# EAGLE design KW-104AL (EAGLE 6.5.0)
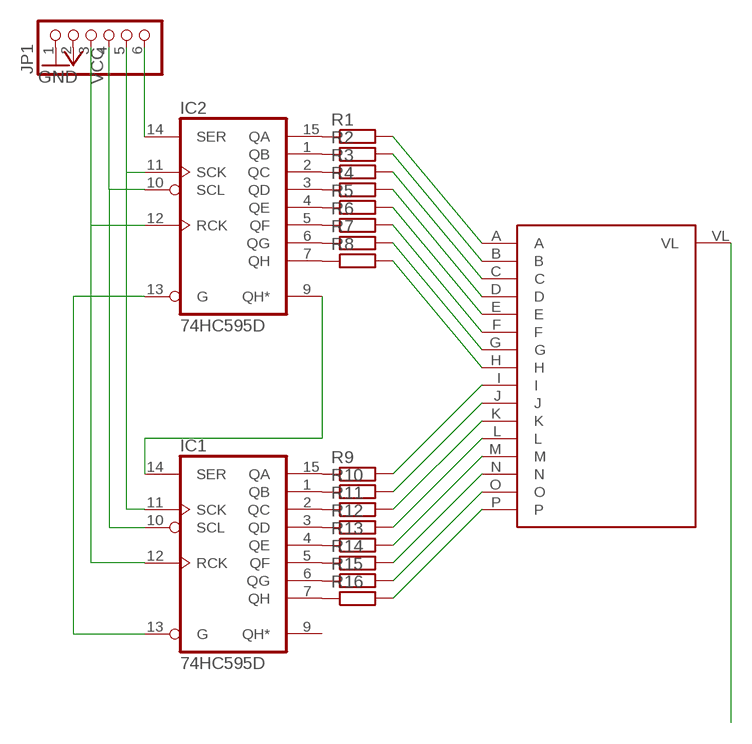
[diagram p0: schematic, sheet 1]

## Parts
IC1  74HC595D  [SO16]
IC2  74HC595D  [SO16]
JP1  PINHD-1X6CB  [1X06-CLEANBIG]
R1  R-EU_R0402  [R0402]
R2  R-EU_R0402  [R0402]
R3  R-EU_R0402  [R0402]
R4  R-EU_R0402  [R0402]
R5  R-EU_R0402  [R0402]
R6  R-EU_R0402  [R0402]
R7  R-EU_R0402  [R0402]
R8  R-EU_R0402  [R0402]
R9  R-EU_R0402  [R0402]
R10  R-EU_R0402  [R0402]
R11  R-EU_R0402  [R0402]
R12  R-EU_R0402  [R0402]
R13  R-EU_R0402  [R0402]
R14  R-EU_R0402  [R0402]
R15  R-EU_R0402  [R0402]
R16  R-EU_R0402  [R0402]
U$1  1.27KW-104AL  [127]

## Nets
GND: JP1.1
N$1: IC1.14(SER) IC2.9(QH*)
N$2: IC1.11(SCK) IC2.11(SCK) JP1.5
N$3: IC1.10(SCL) IC2.10(SCL) JP1.4
N$4: IC1.12(RCK) IC2.12(RCK) JP1.3
N$5: IC1.13(G) IC2.13(G)
N$6: IC2.15(QA) R1.1
N$7: IC2.1(QB) R2.1
N$8: IC2.2(QC) R3.1
N$9: IC2.3(QD) R4.1
N$10: IC2.4(QE) R5.1
N$11: IC2.5(QF) R6.1
N$12: IC2.6(QG) R7.1
N$13: IC2.7(QH) R8.1
N$14: IC1.15(QA) R9.1
N$15: IC1.1(QB) R10.1
N$16: IC1.2(QC) R11.1
N$17: IC1.3(QD) R12.1
N$18: IC1.4(QE) R13.1
N$19: IC1.5(QF) R14.1
N$20: IC1.6(QG) R15.1
N$21: IC1.7(QH) R16.1
N$22: R1.2 U$1.A
N$23: R2.2 U$1.B
N$24: R3.2 U$1.C
N$25: R4.2 U$1.D
N$26: R5.2 U$1.E
N$27: R6.2 U$1.F
N$28: R7.2 U$1.G
N$29: R8.2 U$1.H
N$30: R9.2 U$1.I
N$31: R10.2 U$1.J
N$32: R11.2 U$1.K
N$33: R12.2 U$1.L
N$34: R13.2 U$1.M
N$35: R14.2 U$1.N
N$36: R15.2 U$1.O
N$37: R16.2 U$1.P
N$38: IC2.14(SER) JP1.6
N$39: U$1.VL
VCC: JP1.2
Unconnected: IC1.9(QH*)

## Power pins joined to a net without a drawn wire
GND: IC1.8(GND) IC2.8(GND)
VCC: IC1.16(VCC) IC2.16(VCC)

## Library data of the parts
IC1 IC2 = 74xx-eu:74*595: 8-bit SHIFT REGISTER, output latch
JP1 = adafruit:PINHD-1X6: PIN HEADER
R1-R16 = rcl:R-EU_: RESISTOR, European symbol
U$1 = KW-104AL:1.27

## Board
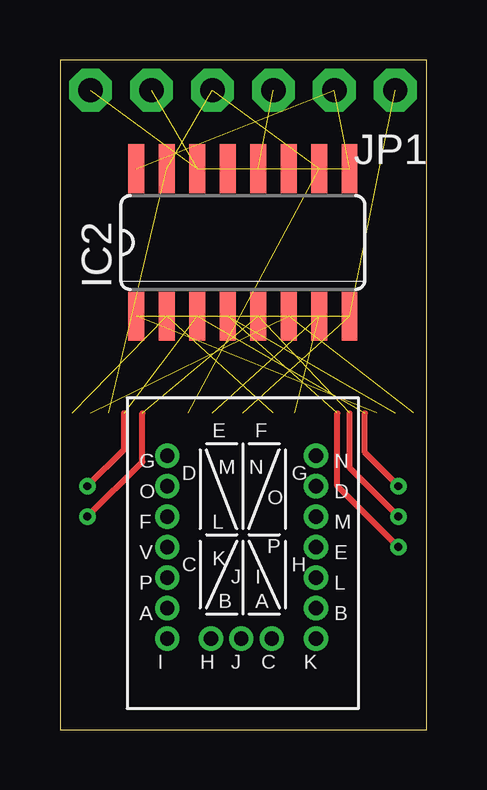
[diagram p1: board, top side]
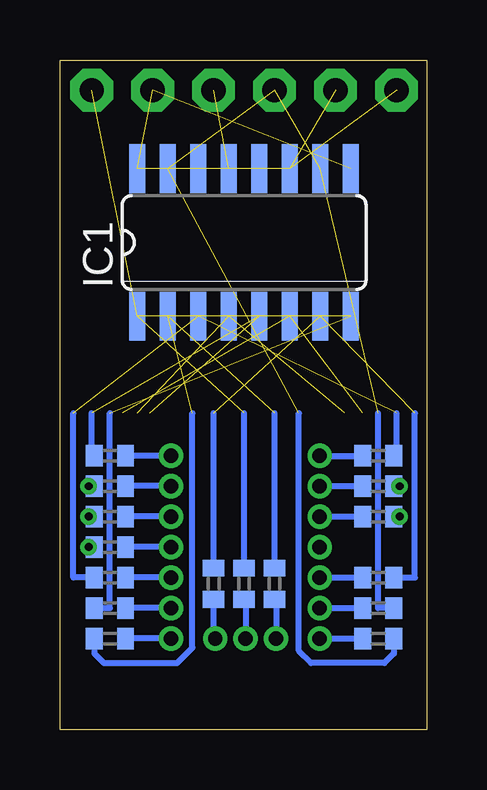
[diagram p2: board, bottom side, seen from below]

Size 15.29 x 27.93 mm. Coordinates in mm from the lower left corner, seen from the top.
Outline: 0,0 15.29,0 15.29,27.93 0,27.93 0,0
Copper layers (1*16): Top 0.0356mm / dielectric 1.5011mm / Bottom 0.0356mm
Design rules "LaenPCBOrder": minimum track width 6mil, minimum drill 13mil, track to track 6mil, track to pad 6mil, pad to pad 6mil, via to via 6mil, smd to smd 6mil, copper to edge 15mil, drill to drill 6mil, minimum pad ring 7mil, minimum via ring 7mil, stop-mask expansion 3mil, vias tented up to drill 0mil, thermal gap 10mil

### Footprints (pad centres in the part's own frame; a part is rotated, then mirrored left to right if it is on the bottom)
SO16 = smd 0.66 x 2.032: 1 -4.445,-3.073; 2 -3.175,-3.073; 3 -1.905,-3.073; 4 -0.635,-3.073; 5 0.635,-3.073; 6 1.905,-3.073; 7 3.175,-3.073; 8 4.445,-3.073; 9 4.445,3.073; 10 3.175,3.073; 11 1.905,3.073; 12 0.635,3.073; 13 -0.635,3.073; 14 -1.905,3.073; 15 -3.175,3.073; 16 -4.445,3.073
1X06-CLEANBIG = drill 1.016 pad 1.778 octagon: 1 -6.35,0; 2 -3.81,0; 3 -1.27,0; 4 1.27,0; 5 3.81,0; 6 6.35,0
R0402 = smd 0.7 x 0.9: 1 -0.65,0; 2 0.65,0
127 = drill 0.6 pad 1.016: A -3.15,-1.778; B 3.048,-1.778; C 1.204,-3.048; D 3.048,3.302; E 3.048,0.762; F -3.15,2.032; G -3.15,4.572; H -1.336,-3.048; I -3.15,-3.048; J -0.066,-3.048; K 3.048,-3.048; L 3.048,-0.508; M 3.048,2.032; N 3.048,4.572; O -3.15,3.302; P -3.15,-0.508; VL -3.15,0.762

### Placement (x,y rotation side)
IC1  7.62,20.32 0 bottom
IC2  7.62,20.32 0 top
JP1  7.62,26.67 180 top
R1  2.03,5.08 180 bottom
R2  13.21,5.08 0 bottom
R3  8.89,6.1 270 bottom
R4  13.21,10.16 0 bottom
R5  13.21,7.62 0 bottom
R6  2.03,8.89 180 bottom
R7  2.03,11.43 180 bottom
R8  6.35,6.1 270 bottom
R9  2.03,3.81 180 bottom
R10  7.62,6.1 270 bottom
R11  13.21,3.81 0 bottom
R12  13.21,6.35 0 bottom
R13  13.21,8.89 0 bottom
R14  13.21,11.43 0 bottom
R15  2.03,10.16 180 bottom
R16  2.03,6.35 180 bottom
U$1  7.62,6.86 0 top

### Tracks (layer width: path | path; a pad name or v marks a point on that pad's centre or on a via)
GND  (2 unrouted)
N$1  (1 unrouted)
N$2  (2 unrouted)
N$3  (2 unrouted)
N$4  (2 unrouted)
N$5  (1 unrouted)
N$6  (1 unrouted)
  Bottom 0.254: R1.1 2.03,5.08 2.03,13.21
N$7  (1 unrouted)
  Bottom 0.254: R2.1 13.21,5.08 13.21,13.21
N$8  (1 unrouted)
  Bottom 0.254: R3.1 8.89,13.21
N$9  (via drill 0.33 pad 0.61)  (1 unrouted)
  Top 0.254: v14.1,10.16 12.7,11.56 12.7,13.21
  Bottom 0.254: R4.1 v14.1,10.16
N$10  (via drill 0.33 pad 0.61)  (1 unrouted)
  Top 0.254: v14.1,7.62 11.56,10.16 11.56,13.21
  Bottom 0.254: R5.1 v14.1,7.62
N$11  (via drill 0.33 pad 0.61)  (1 unrouted)
  Top 0.254: v1.14,8.89 3.43,11.18 3.43,13.21
  Bottom 0.254: R6.1 v1.14,8.89
N$12  (1 unrouted)
  Bottom 0.254: R7.1 1.27,11.54 1.27,13.21
N$13  (1 unrouted)
  Bottom 0.254: R8.1 6.35,13.21
N$14  (1 unrouted)
  Bottom 0.254: R9.1 1.38,3.19 1.78,2.79 4.83,2.79 5.33,3.3 5.33,13.21
N$15  (1 unrouted)
  Bottom 0.254: R10.1 7.62,13.21
N$16  (1 unrouted)
  Bottom 0.254: R11.1 13.86,3.19 13.46,2.79 10.41,2.79 9.78,3.43 9.78,13.21
N$17  (1 unrouted)
  Bottom 0.254: R12.1 14.73,6.35 14.73,13.21
N$18  (via drill 0.33 pad 0.61)  (1 unrouted)
  Top 0.254: v14.1,8.89 12.06,10.92 12.06,13.21
  Bottom 0.254: R13.1 v14.1,8.89
N$19  (1 unrouted)
  Bottom 0.254: R14.1 13.97,11.57 13.97,13.21
N$20  (via drill 0.33 pad 0.61)  (1 unrouted)
  Top 0.254: v1.14,10.16 2.67,11.68 2.67,13.21
  Bottom 0.254: R15.1 v1.14,10.16
N$21  (1 unrouted)
  Bottom 0.254: R16.1 0.51,6.35 0.51,13.21
N$22
  Bottom 0.254: U$1.A R1.2
N$23
  Bottom 0.254: U$1.B R2.2
N$24
  Bottom 0.254: U$1.C 8.89,3.81 R3.2
N$25
  Bottom 0.254: U$1.D R4.2
N$26
  Bottom 0.254: U$1.E R5.2
N$27
  Bottom 0.254: U$1.F R6.2
N$28
  Bottom 0.254: U$1.G R7.2
N$29
  Bottom 0.254: R8.2 6.28,5.45 U$1.H
N$30
  Bottom 0.254: U$1.I R9.2
N$31
  Bottom 0.254: R10.2 7.55,5.45 U$1.J
N$32
  Bottom 0.254: U$1.K R11.2
N$33
  Bottom 0.254: U$1.L R12.2
N$34
  Bottom 0.254: U$1.M R13.2
N$35
  Bottom 0.254: U$1.N R14.2
N$36
  Bottom 0.254: U$1.O R15.2
N$37
  Bottom 0.254: U$1.P R16.2
N$38  (1 unrouted)
VCC  (2 unrouted)